# Altium schematic sheet FPGA2.SchDoc
size A4; SheetNumber: 8; SheetTotal: 9
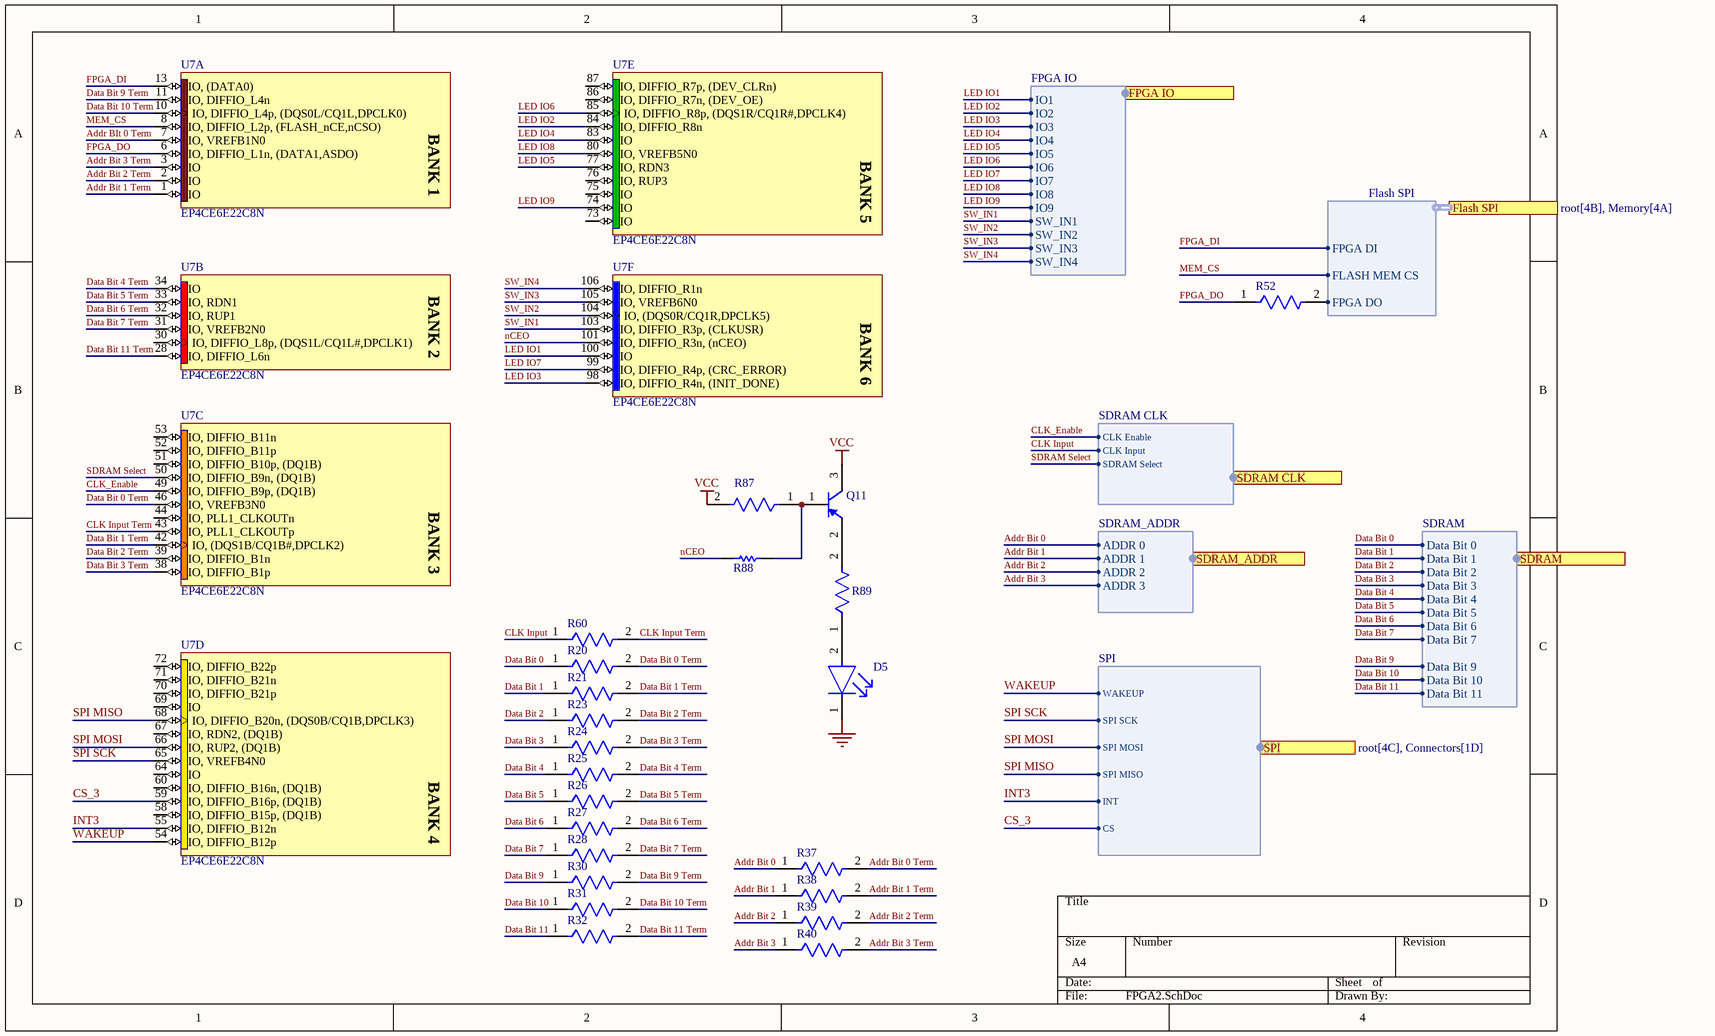
[diagram p0: FPGA2.SchDoc]

## Parts
D5  APHCM2012CGCK-F01  [FP-APHCM2012CGCK-F01-MFG]  (value not drawn)
Q11  MMBT3906LT1G  [ONSC-SOT-23-3-318-08_V]  (value not drawn)
R20  RT0402BRE0750RL  [FP-RT0402-0_35-MFG]  (value not drawn)
R21  RT0402BRE0750RL  [FP-RT0402-0_35-MFG]  (value not drawn)
R23  RT0402BRE0750RL  [FP-RT0402-0_35-MFG]  (value not drawn)
R24  RT0402BRE0750RL  [FP-RT0402-0_35-MFG]  (value not drawn)
R25  RT0402BRE0750RL  [FP-RT0402-0_35-MFG]  (value not drawn)
R26  RT0402BRE0750RL  [FP-RT0402-0_35-MFG]  (value not drawn)
R27  RT0402BRE0750RL  [FP-RT0402-0_35-MFG]  (value not drawn)
R28  RT0402BRE0750RL  [FP-RT0402-0_35-MFG]  (value not drawn)
R30  RT0402BRE0750RL  [FP-RT0402-0_35-MFG]  (value not drawn)
R31  RT0402BRE0750RL  [FP-RT0402-0_35-MFG]  (value not drawn)
R32  RT0402BRE0750RL  [FP-RT0402-0_35-MFG]  (value not drawn)
R37  RT0402BRE0750RL  [FP-RT0402-0_35-MFG]  (value not drawn)
R38  RT0402BRE0750RL  [FP-RT0402-0_35-MFG]  (value not drawn)
R39  RT0402BRE0750RL  [FP-RT0402-0_35-MFG]  (value not drawn)
R40  RT0402BRE0750RL  [FP-RT0402-0_35-MFG]  (value not drawn)
R52  RT0402BRE0750RL  [FP-RT0402-0_35-MFG]  (value not drawn)
R60  RT0402BRE0750RL  [FP-RT0402-0_35-MFG]  (value not drawn)
R87  RC0603FR-0710KL  [FP-RC0603-0_55-IPC_C]  (value not drawn)
R88  RC0402FR-07330RL  [RESC1005X40X25LL05T10]  (value not drawn)
R89  RC0603FR-0710KL  [FP-RC0603-0_55-IPC_C]  (value not drawn)
U7  EP4CE6E22C8N  [EQFP144_A-165_D2-54_M]  (parts A,B,C,D,E,F of 13)

## Ports
Flash SPI (harness Flash SPI, see root[4B], Memory[4A]), FPGA IO (harness FPGA IO, see root[4B], IOs[1A]), SDRAM (harness SDRAM, see root[4B], Memory[4B]), SDRAM CLK (harness SDRAM CLK, see root[4C], Memory[2D]), SDRAM_ADDR (harness SDRAM_ADDR, see root[4B], Memory[2C]), SPI (harness SPI, see root[4C], Connectors[1D])

## Harnesses
FPGA IO: IO1, IO2, IO3, IO4, IO5, IO6, IO7, IO8, IO9, SW_IN1, SW_IN2, SW_IN3, SW_IN4
Flash SPI: FPGA DI, FLASH MEM CS, FPGA DO
SDRAM: Data Bit 0, Data Bit 1, Data Bit 2, Data Bit 3, Data Bit 4, Data Bit 5, Data Bit 6, Data Bit 7, Data Bit 9, Data Bit 10, Data Bit 11
SDRAM_ADDR: ADDR 0, ADDR 1, ADDR 2, ADDR 3
SDRAM CLK: CLK Enable, CLK Input, SDRAM Select
SPI: WAKEUP, SPI SCK, SPI MOSI, SPI MISO, INT, CS

## Nets
GND: D5.1(C)
VCC: Q11.3(C) R87.2
Addr Bit 0: R37.1 ; port SDRAM_ADDR.ADDR 0
Addr BIt 0 Term: R37.2 U7.7(IO,_VREFB1N0)
Addr Bit 1: R38.1 ; port SDRAM_ADDR.ADDR 1
Addr Bit 1 Term: R38.2 U7.1(IO)
Addr Bit 2: R39.1 ; port SDRAM_ADDR.ADDR 2
Addr Bit 2 Term: R39.2 U7.2(IO)
Addr Bit 3: R40.1 ; port SDRAM_ADDR.ADDR 3
Addr Bit 3 Term: R40.2 U7.3(IO)
CLK Input: R60.1 ; port SDRAM CLK.CLK Input
CLK Input Term: R60.2 U7.43(IO,_PLL1_CLKOUTp)
CLK_Enable: U7.49(IO,_DIFFIO_B9p,_(DQ1B)) ; port SDRAM CLK.CLK Enable
CS_3: U7.59(IO,_DIFFIO_B16p,_(DQ1B)) ; port SPI.CS
Data Bit 0: R20.1 ; port SDRAM.Data Bit 0
Data Bit 0 Term: R20.2 U7.46(IO,_VREFB3N0)
Data Bit 1: R21.1 ; port SDRAM.Data Bit 1
Data Bit 1 Term: R21.2 U7.42(IO,_(DQS1B/CQ1B#,DPCLK2))
Data Bit 2: R23.1 ; port SDRAM.Data Bit 2
Data Bit 2 Term: R23.2 U7.39(IO,_DIFFIO_B1n)
Data Bit 3: R24.1 ; port SDRAM.Data Bit 3
Data Bit 3 Term: R24.2 U7.38(IO,_DIFFIO_B1p)
Data Bit 4: R25.1 ; port SDRAM.Data Bit 4
Data Bit 4 Term: R25.2 U7.34(IO)
Data Bit 5: R26.1 ; port SDRAM.Data Bit 5
Data Bit 5 Term: R26.2 U7.33(IO,_RDN1)
Data Bit 6: R27.1 ; port SDRAM.Data Bit 6
Data Bit 6 Term: R27.2 U7.32(IO,_RUP1)
Data Bit 7: R28.1 ; port SDRAM.Data Bit 7
Data Bit 7 Term: R28.2 U7.31(IO,_VREFB2N0)
Data Bit 9: R30.1 ; port SDRAM.Data Bit 9
Data Bit 9 Term: R30.2 U7.11(IO,_DIFFIO_L4n)
Data Bit 10: R31.1 ; port SDRAM.Data Bit 10
Data Bit 10 Term: R31.2 U7.10(IO,_DIFFIO_L4p,_(DQS0L/CQ1L,DPCLK0))
Data Bit 11: R32.1 ; port SDRAM.Data Bit 11
Data Bit 11 Term: R32.2 U7.28(IO,_DIFFIO_L6n)
FPGA_DI: U7.13(IO,_(DATA0)) ; port Flash SPI.FPGA DI
FPGA_DO: R52.1 U7.6(IO,_DIFFIO_L1n,_(DATA1,ASDO))
INT3: U7.55(IO,_DIFFIO_B12n) ; port SPI.INT
LED IO1: U7.100(IO) ; port FPGA IO.IO1
LED IO2: U7.84(IO,_DIFFIO_R8n) ; port FPGA IO.IO2
LED IO3: U7.98(IO,_DIFFIO_R4n,_(INIT_DONE)) ; port FPGA IO.IO3
LED IO4: U7.83(IO) ; port FPGA IO.IO4
LED IO5: U7.77(IO,_RDN3) ; port FPGA IO.IO5
LED IO6: U7.85(IO,_DIFFIO_R8p,_(DQS1R/CQ1R#,DPCLK4)) ; port FPGA IO.IO6
LED IO7: U7.99(IO,_DIFFIO_R4p,_(CRC_ERROR)) ; port FPGA IO.IO7
LED IO8: U7.80(IO,_VREFB5N0) ; port FPGA IO.IO8
LED IO9: U7.74(IO) ; port FPGA IO.IO9
MEM_CS: U7.8(IO,_DIFFIO_L2p,_(FLASH_nCE,nCSO)) ; port Flash SPI.FLASH MEM CS
nCEO: R88.2 U7.101(IO,_DIFFIO_R3n,_(nCEO))
SDRAM Select: U7.50(IO,_DIFFIO_B9n,_(DQ1B)) ; port SDRAM CLK.SDRAM Select
SPI MISO: U7.68(IO,_DIFFIO_B20n,_(DQS0B/CQ1B,DPCLK3)) ; port SPI.SPI MISO
SPI MOSI: U7.66(IO,_RUP2,_(DQ1B)) ; port SPI.SPI MOSI
SPI SCK: U7.65(IO,_VREFB4N0) ; port SPI.SPI SCK
SW_IN1: U7.103(IO,_DIFFIO_R3p,_(CLKUSR)) ; port FPGA IO.SW_IN1
SW_IN2: U7.104(IO,_(DQS0R/CQ1R,DPCLK5)) ; port FPGA IO.SW_IN2
SW_IN3: U7.105(IO,_VREFB6N0) ; port FPGA IO.SW_IN3
SW_IN4: U7.106(IO,_DIFFIO_R1n) ; port FPGA IO.SW_IN4
WAKEUP: U7.54(IO,_DIFFIO_B12p) ; port SPI.WAKEUP
NetD5_2: D5.2(A) R89.1
NetQ11_1: Q11.1(B) R87.1 R88.1
NetQ11_2: Q11.2(E) R89.2
NetR52_2: R52.2 ; port Flash SPI.FPGA DO

Not connected (* = marked no-connect by the designer): U7 30(IO,_DIFFIO_L8p,_(DQS1L/CQ1L#,DPCLK1)) 44(IO,_PLL1_CLKOUTn) 51(IO,_DIFFIO_B10p,_(DQ1B)) 52(IO,_DIFFIO_B11p) 53(IO,_DIFFIO_B11n) 58(IO,_DIFFIO_B15p,_(DQ1B)) 60(IO,_DIFFIO_B16n,_(DQ1B)) 64(IO) 67(IO,_RDN2,_(DQ1B)) 69(IO) 70(IO,_DIFFIO_B21p) 71(IO,_DIFFIO_B21n) 72(IO,_DIFFIO_B22p) 73(IO) 75(IO) 76(IO,_RUP3) 86(IO,_DIFFIO_R7n,_(DEV_OE)) 87(IO,_DIFFIO_R7p,_(DEV_CLRn))

## Notes on the sheet
- (in symbol CMP-0038-00212-1, part A) BANK 1
- (in symbol CMP-0038-00212-1, part B) BANK 2
- (in symbol CMP-0038-00212-1, part C) BANK 3
- (in symbol CMP-0038-00212-1, part D) BANK 4
- (in symbol CMP-0038-00212-1, part E) BANK 5
- (in symbol CMP-0038-00212-1, part F) BANK 6

## Library data of the parts
D5 = CMP-44529-000062-1: LED GREEN CLEAR CHIP SMD; Dominant Wavelength: 570nm; Forward Current: 20mA; Number of LEDs: 1; Luminous Intensity: 40mcd; Forward Voltage: 2.1V; Viewing Angle: 110°; Illumination Color: Green; Lens Style: Clear; Mount: Surface Mount; Length: 2mm; Max Operating Temperature: 85°C; Series: APHCM; Width: 1.25mm; Lead Free: Lead Free; Wavelength: 570nm; Package Quantity: 1; Number of Pins: 2; Case Code (Metric): 2012; RoHS Compliant: Yes; Packaging: Tape and Reel; Lens Color: Clear; Case/Package: 0805; Case Code (Imperial): 0805; Test Current: 20mA; Color: Green; Min Operating Temperature: -40°C; Height: 0.4mm
Q11 = CMP-1048-00670-1: General Purpose Transistor, PNP Silicon, 3-Pin SOT-23, Pb-Free, Tape and Reel; Manufacturer: On Semiconductor; IC Continuous (A): -0.2; fT Min (MHz): 250; PackageDescription: 3-Pin Small Outline Transistor, Body 2.92 x 1.3 mm, Pitch 0.95 mm; PartNumber: MMBT3906LT1G; Packing: Tape and Reel; ComponentLink3Description: Package Specification; Mounting Technology: Surface Mount; ComponentLink3URL: http://www.onsemi.cn/pub_link/Collateral/318-08.PDF; ComponentLink1URL: http://www.onsemi.com/; ComponentLink2URL: http://www.onsemi.cn/pub_link/Collateral/MMBT3906LT1-D.PDF; PackageReference: SOT-23-3-318-08; Polarity: PNP; ComponentLink2Description: Datasheet; PackageVersion: Rev. AP, 11/2009; RoHS: TRUE; DatasheetVersion: Rev. 11; ComponentLink1Description: Manufacturer URL
R20 R21 R23-R28 R30-R32 R37-R40 R52 R60 = CMP-00621-71392720-1: RT0402BRE0750RL Fixed Resistor, Thin Film, 0.0625W, 50ohm, 50V, 0.1% +/-Tol, 50ppm/Cel, Surface Mount, 0402; Max Power Dissipation: 63mW; Temperature Coefficient: 50ppm/°C; Resistance: 50Ω; Features: Moisture Resistant; Max Operating Temperature: 155°C; Tolerance: 0.1%; Min Operating Temperature: -55°C; Case/Package: 0402; Packaging: Tape & Reel; RoHS: Compliant; Width: 508µm; Height: 355.6µm; NexarPartId: 71392720; Composition: Thin Film; Length: 990.6µm; Number of Terminations: 2
R87 R89 = CMP-2100-03664-2: RES 10K OHM 1% 1/10W 0603; Voltage Rating: 75V; Voltage Rating (DC): 50V; Resistance: 10kR; Power Rating: 100mW; Temperature Coefficient: 100ppm/°C; Depth: 0.8mm; Termination: SMD/SMT; Resistor Type: Thick Film; Series: RC; Construction: Rectangular; Features: Moisture Resistant; Packaging: Tape and Reel; Min Operating Temperature: -55°C; Number of Terminations: 2; Lead Pitch: 0.3mm; RoHS Compliant: Yes; Case/Package: 0603; Resistance Tolerance: 1%; Military Standard: Not; Weight: 7.1E-05oz; Number of Pins: 2; Tolerance: 1%; Length: 1.6mm; Case Code (Imperial): 0603; Lead Free: Lead Free; Width: 0.8mm; Max Power Dissipation: 100mW; Height: 0.45mm; Max Operating Temperature: 155°C; Case Code (Metric): 1608; Size Code: 0603
R88 = CMP-2002-07613-1: Manufacturer: Yageo / Phycomp; Part Number: RC0402FR-07330RL
U7 = CMP-0038-00212-1: Cyclone IV Family FPGA, 1.2V Core, 91 I/O Pins, 2 PLLs, 144-Pin QFP, Speed Grade 8, Commercial Grade, Pb-Free; Manufacturer: Altera; ComponentLink3Description: Pinout; ComponentLink4Description: Package Specification; DatasheetVersion: ver1.6, Nov-2011; ComponentLink1URL: http://www.altera.com/; ComponentLink2URL: http://www.altera.com/literature/hb/cyclone-iv/cyclone4-handbook.pdf; ComponentLink2Description: Handbook; PackageReference: EQFP144_A-165_D2-54; ComponentLink3URL: http://www.altera.com/literature/lit-dp.jsp?category=cyc%204&showspreadsheet=y; PackageVersion: ver1.0, Jan-2011; ComponentLink1Description: Manufacturer URL; ComponentLink4URL: http://www.altera.com/devicepackaging/04R00402-00.pdf; PackageDescription: 144-Pin Plastic Enhanced Quad Flat Pack (EQFP) - Wire Bond - A:1.65 - D2:5.4; Code_JEDEC: MS-026-BFB-HD